# EAGLE design luftdaten_v1r1 (EAGLE 9.3.0)
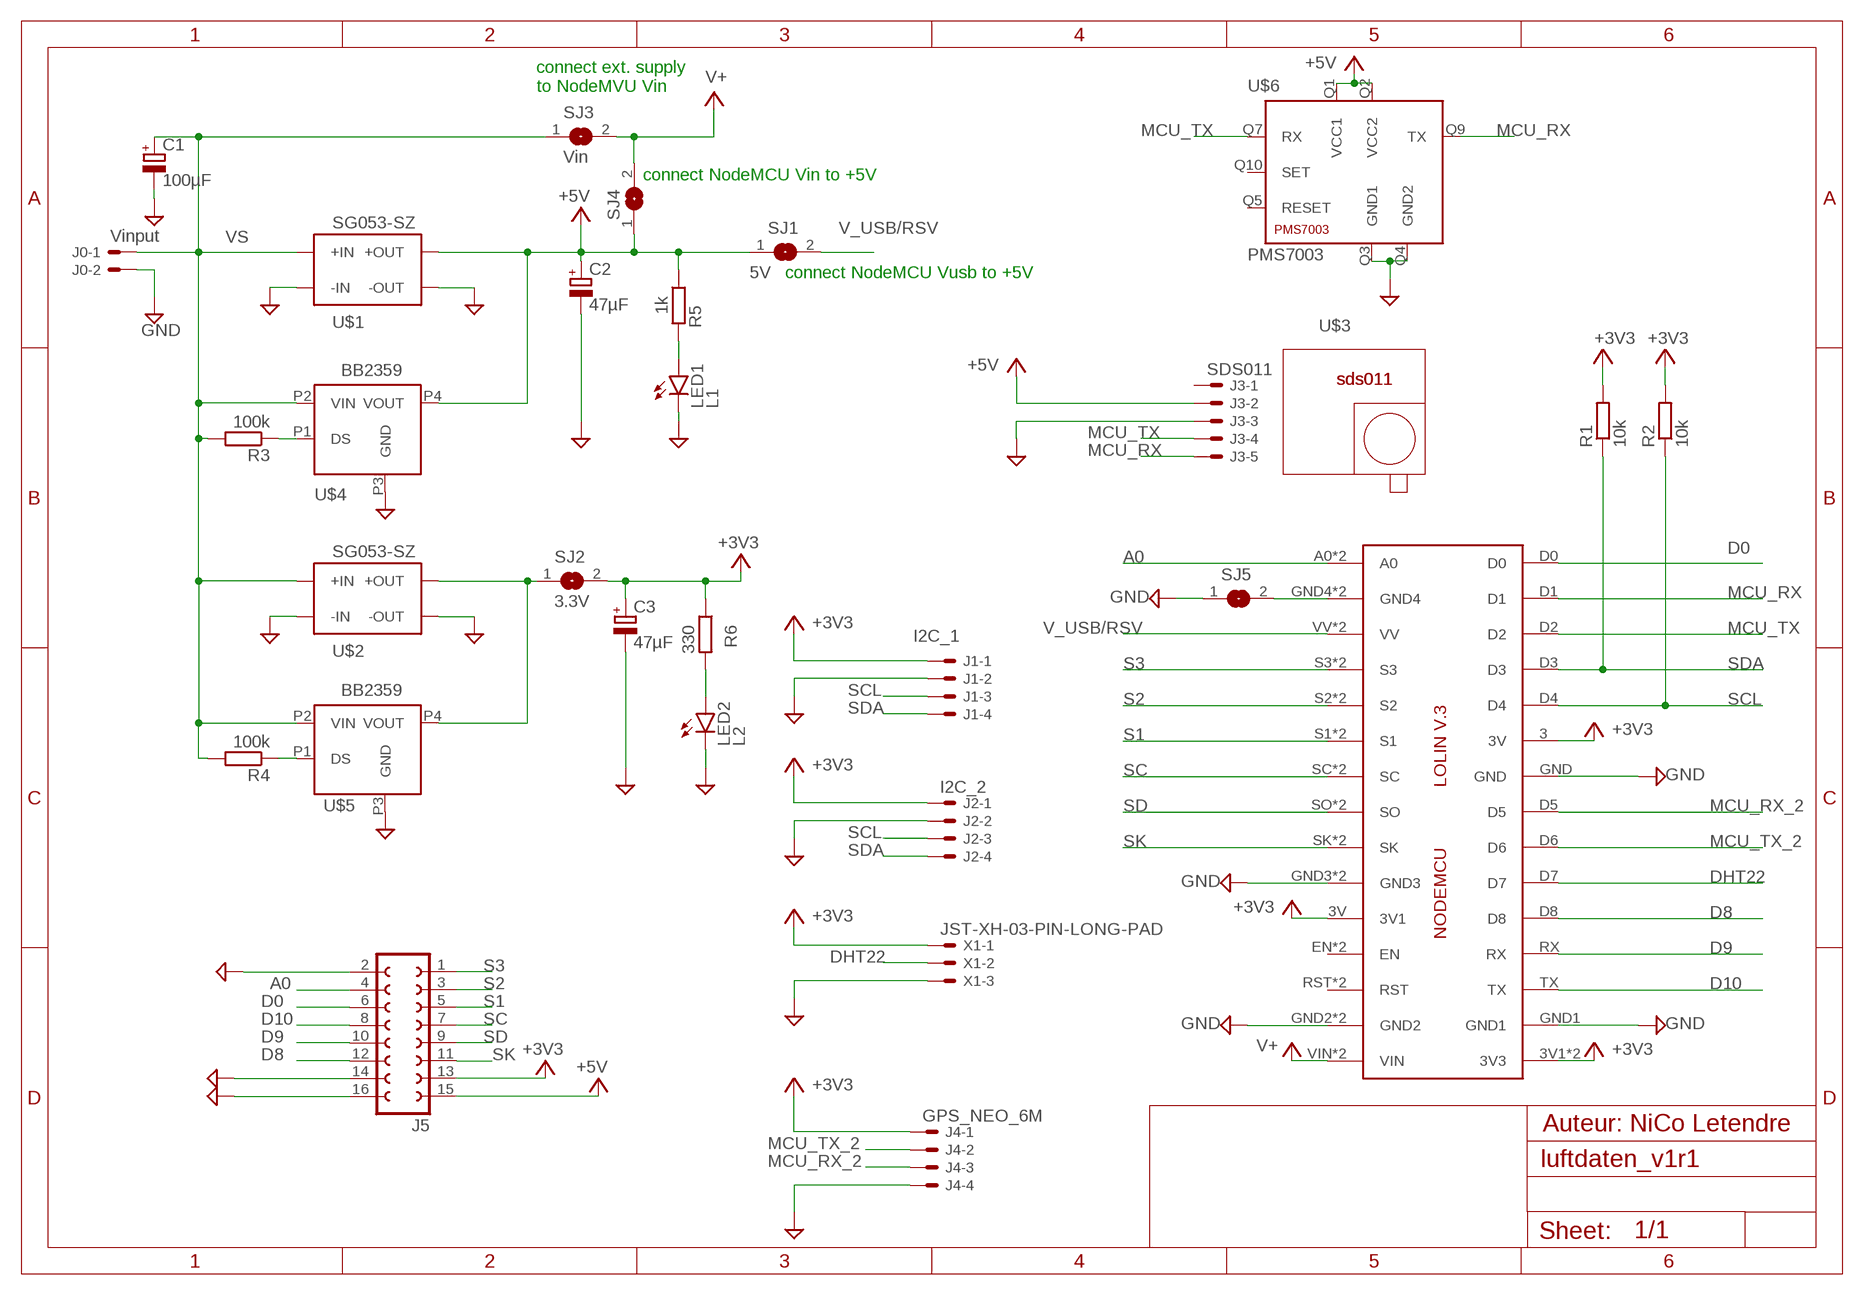
[diagram p0: schematic, sheet 1]

## Parts
C1  100µF  CPOL-EUE3.5-8  [E3,5-8]
C2  47µF  CPOL-EUE2.5-5  [E2,5-5]
C3  47µF  CPOL-EUE2.5-5  [E2,5-5]
IC2  NodeMCU  LOLINV3  [LOLINV3]
J0  Vinput  JST-XH-02-PIN-LONG-PAD  [JST-XH-02-PACKAGE-LONG-PAD]
J1  I2C_1  JST-XH-04-PIN-LONG-PAD  [JST-XH-04-PACKAGE-LONG-PAD]
J2  I2C_2  JST-XH-04-PIN-LONG-PAD  [JST-XH-04-PACKAGE-LONG-PAD]
J3  SDS011  JST-XH-05-PIN-LONG-PAD  [JST-XH-05-PACKAGE-LONG-PAD]
J4  GPS_NEO_6M  JST-XH-04-PIN-LONG-PAD  [JST-XH-04-PACKAGE-LONG-PAD]
J5  FE08-2  [FE08-2]
LED1  L1  LEDCHIPLED_0805  [CHIPLED_0805]
LED2  L2  LEDCHIPLED_0805  [CHIPLED_0805]
R1  10k  R-EU_R0805  [R0805]
R2  10k  R-EU_R0805  [R0805]
R3  100k  R-EU_R0805  [R0805]
R4  100k  R-EU_R0805  [R0805]
R5  1k  R-EU_R0805  [R0805]
R6  330  R-EU_R0805  [R0805]
SJ1  5V  SJ  [SJ]
SJ2  3.3V  SJ  [SJ]
SJ3  Vin  SJ  [SJ]
SJ4  SJ  [SJ]
SJ5  SJ  [SJ]
U$1  SG053-SZ  [SG053-SZ]
U$2  SG053-SZ  [SG053-SZ]
U$3  SDSO11  [SDS011]
U$4  BB2359  [BB2359]
U$5  BB2359  [BB2359]
U$6  PMS7003  [PMS7003]
X1  JST-XH-03-PIN-LONG-PAD  [JST-XH-03-PACKAGE-LONG-PAD]

## Nets
+3V3: C3.+ IC2.3(3V) IC2.3V1(3V3) IC2.3V3 IC2.3V(3V1) J1.1 J2.1 J4.1 J5.13 R1.2 R2.2 R6.1 SJ2.2 X1.1
+5V: C2.+ J3.2 J5.15 R5.1 SJ1.1 SJ4.1 U$1.P$5(+OUT) U$1.P$6(+OUT) U$4.P4(VOUT) U$6.Q1(VCC1) U$6.Q2(VCC2)
A0: IC2.A0 IC2.A1(A0) J5.4
D0: IC2.D0 J5.6
D8: IC2.D8 J5.12
D9: IC2.RX J5.10
D10: IC2.TX J5.8
DHT22: IC2.D7 X1.2
GND: C1.- C2.- C3.- IC2.GND IC2.GND1 IC2.GND2 IC2.GND3 IC2.GND5(GND2) IC2.GND6(GND3) J0.2 J1.2 J2.2 J3.3 J4.4 J5.2 J5.14 J5.16 LED1.C LED2.C SJ5.1 U$1.P$1(-IN) U$1.P$2(-IN) U$1.P$7(-OUT) U$1.P$8(-OUT) U$2.P$1(-IN) U$2.P$2(-IN) U$2.P$7(-OUT) U$2.P$8(-OUT) U$4.P3(GND) U$5.P3(GND) U$6.Q3(GND1) U$6.Q4(GND2) X1.3
MCU_RX: IC2.D1 J3.5 U$6.Q9(TX)
MCU_RX_2: IC2.D5 J4.3
MCU_TX: IC2.D2 J3.4 U$6.Q7(RX)
MCU_TX_2: IC2.D6 J4.2
N$1: IC2.GND4 IC2.GND7(GND4) SJ5.2
N$2: SJ2.1 U$2.P$5(+OUT) U$2.P$6(+OUT) U$5.P4(VOUT)
N$3: R3.1 U$4.P1(DS)
N$4: R4.1 U$5.P1(DS)
N$7: LED1.A R5.2
N$8: LED2.A R6.2
S1: IC2.S1 IC2.S4(S1) J5.5
S2: IC2.S2 IC2.S5(S2) J5.3
S3: IC2.S3 IC2.S6(S3) J5.1
SC: IC2.SC IC2.SC1(SC) J5.7
SCL: IC2.D4 J1.3 J2.3 R2.1
SD: IC2.SO IC2.SO1(SO) J5.9
SDA: IC2.D3 J1.4 J2.4 R1.1
SK: IC2.SK IC2.SK1(SK) J5.11
V+: IC2.VIN IC2.VIN1(VIN) SJ3.2 SJ4.2
V_USB/RSV: IC2.VV IC2.VV1(VV) SJ1.2
VS: C1.+ J0.1 R3.2 R4.2 SJ3.1 U$1.P$3(+IN) U$1.P$4(+IN) U$2.P$3(+IN) U$2.P$4(+IN) U$4.P2(VIN) U$5.P2(VIN)
Unconnected: IC2.EN IC2.EN1(EN) IC2.RST IC2.RST1(RST) J3.1 U$6.Q5(RESET) U$6.Q10(SET)

## Notes on the sheet
- connect ext. supply
  to NodeMVU Vin
- connect NodeMCU Vin to +5V
- connect NodeMCU Vusb to +5V
- Auteur: NiCo Letendre

## Library data of the parts
C1-C3 = rcl-perso:CPOL-EU: POLARIZED CAPACITOR, European symbol; SPICEPREFIX: C
IC2 = Lolin:LOLINV3
J0 = Rembrandt Electronics - JST XH Connectors v1-0:JST-XH-02-PIN: JST XH Connector 2 Pin Wire to board connector. Pitch: 2,54 mm, (0.100") Number of pins: 2 Created by Rembrandt Electronics www.rembrandtelectronics.com
J1 J2 J4 = Rembrandt Electronics - JST XH Connectors v1-0:JST-XH-04-PIN: JST XH Connector 2 Pin Wire to board connector. Pitch: 2,54 mm, (0.100") Number of pins: 4 Created by Rembrandt Electronics www.rembrandtelectronics.com
J3 = Rembrandt Electronics - JST XH Connectors v1-0:JST-XH-05-PIN: JST XH Connector 2 Pin Wire to board connector. Pitch: 2,54 mm, (0.100") Number of pins: 5 Created by Rembrandt Electronics www.rembrandtelectronics.com
J5 = header-1p27-perso:FE08-2: FEMALE HEADER; OC_FARNELL: unknown; OC_NEWARK: unknown
LED1 LED2 = led:LED: LED OSRAM: - CHIPLED LG R971, LG N971, LY N971, LG Q971, LY Q971, LO R971, LY R971 LH N974, LH R974 LS Q976, LO Q976, LY Q976 LO Q996 - Hyper CHIPLED LW Q18S LB Q993, LB Q99A, LB R99A - SideLED LS A670, LO A670, LY A670, LG A670, LP A670 LB A673, LV A673, LT A673, LW A673 LH A674 LY A675 LS A676, LA A676, LO A676, LY A676, LW A676 LS A679, LY A679, LG A679 - Hyper Micro SIDELED® LS Y876, LA Y876, LO Y876, LY Y876 LT Y87S - SmartLED LW L88C, LW L88S LB L89C, LB L89S, LG L890 LS L89K, LO L89K, LY L89K LS L896, LA L896, LO L896, LY L896 - TOPLED LS T670, LO T670, LY T670, LG T670, LP T670 LSG T670, LSP T670, LSY T670, LOP T670, LYG T670 LG T671, LOG T671, LSG T671 LB T673, LV T673, LT T673, LW T673 LH T674 LS T676, LA T676, LO T676, LY T676, LB T676, LH T676, LSB T676, LW T676 LB T67C, LV T67C, LT T67C, LS T67K, LO T67K, LY T67K, LW E67C LS E67B, LA E67B, LO E67B, LY E67B, LB E67C, LV E67C, LT E67C LW T67C LS T679, LY T679, LG T679 LS T770, LO T770, LY T770, LG T770, LP T770 LB T773, LV T773, LT T773, LW T773 LH T774 LS E675, LA E675, LY E675, LS T675 LS T776, LA T776, LO T776, LY T776, LB T776 LHGB T686 LT T68C, LB T68C - Hyper Mini TOPLED® LB M676 - Mini TOPLED Santana® LG M470 LS M47K, LO M47K, LY M47K Source: http://www.osram.convergy.de LUXEON: - LUMILED® LXK2-PW12-R00, LXK2-PW12-S00, LXK2-PW14-U00, LXK2-PW14-V00 LXK2-PM12-R00, LXK2-PM12-S00, LXK2-PM14-U00 LXK2-PE12-Q00, LXK2-PE12-R00, LXK2-PE12-S00, LXK2-PE14-T00, LXK2-PE14-U00 LXK2-PB12-K00, LXK2-PB12-L00, LXK2-PB12-M00, LXK2-PB14-N00, LXK2-PB14-P00, LXK2-PB14-Q00 LXK2-PR12-L00, LXK2-PR12-M00, LXK2-PR14-Q00, LXK2-PR14-R00 LXK2-PD12-Q00, LXK2-PD12-R00, LXK2-PD12-S00 LXK2-PH12-R00, LXK2-PH12-S00 LXK2-PL12-P00, LXK2-PL12-Q00, LXK2-PL12-R00 Source: www.luxeon.com KINGBRIGHT: KA-3528ASYC Source: www.kingbright.com
R1-R6 = rcl:R-EU_: RESISTOR, European symbol; SPICEPREFIX: R
SJ1-SJ5 = jumper:SJ: SMD solder JUMPER
U$1 U$2 = dcdc-powermodules:SG053-SZ
U$3 = sds011:SDSO11
U$4 U$5 = bb2359:BB2359
U$6 = pms7003:PMS7003
X1 = Rembrandt Electronics - JST XH Connectors v1-0:JST-XH-03-PIN: JST XH Connector 2 Pin Wire to board connector. Pitch: 2,54 mm, (0.100") Number of pins: 3 Created by Rembrandt Electronics www.rembrandtelectronics.com

## Board
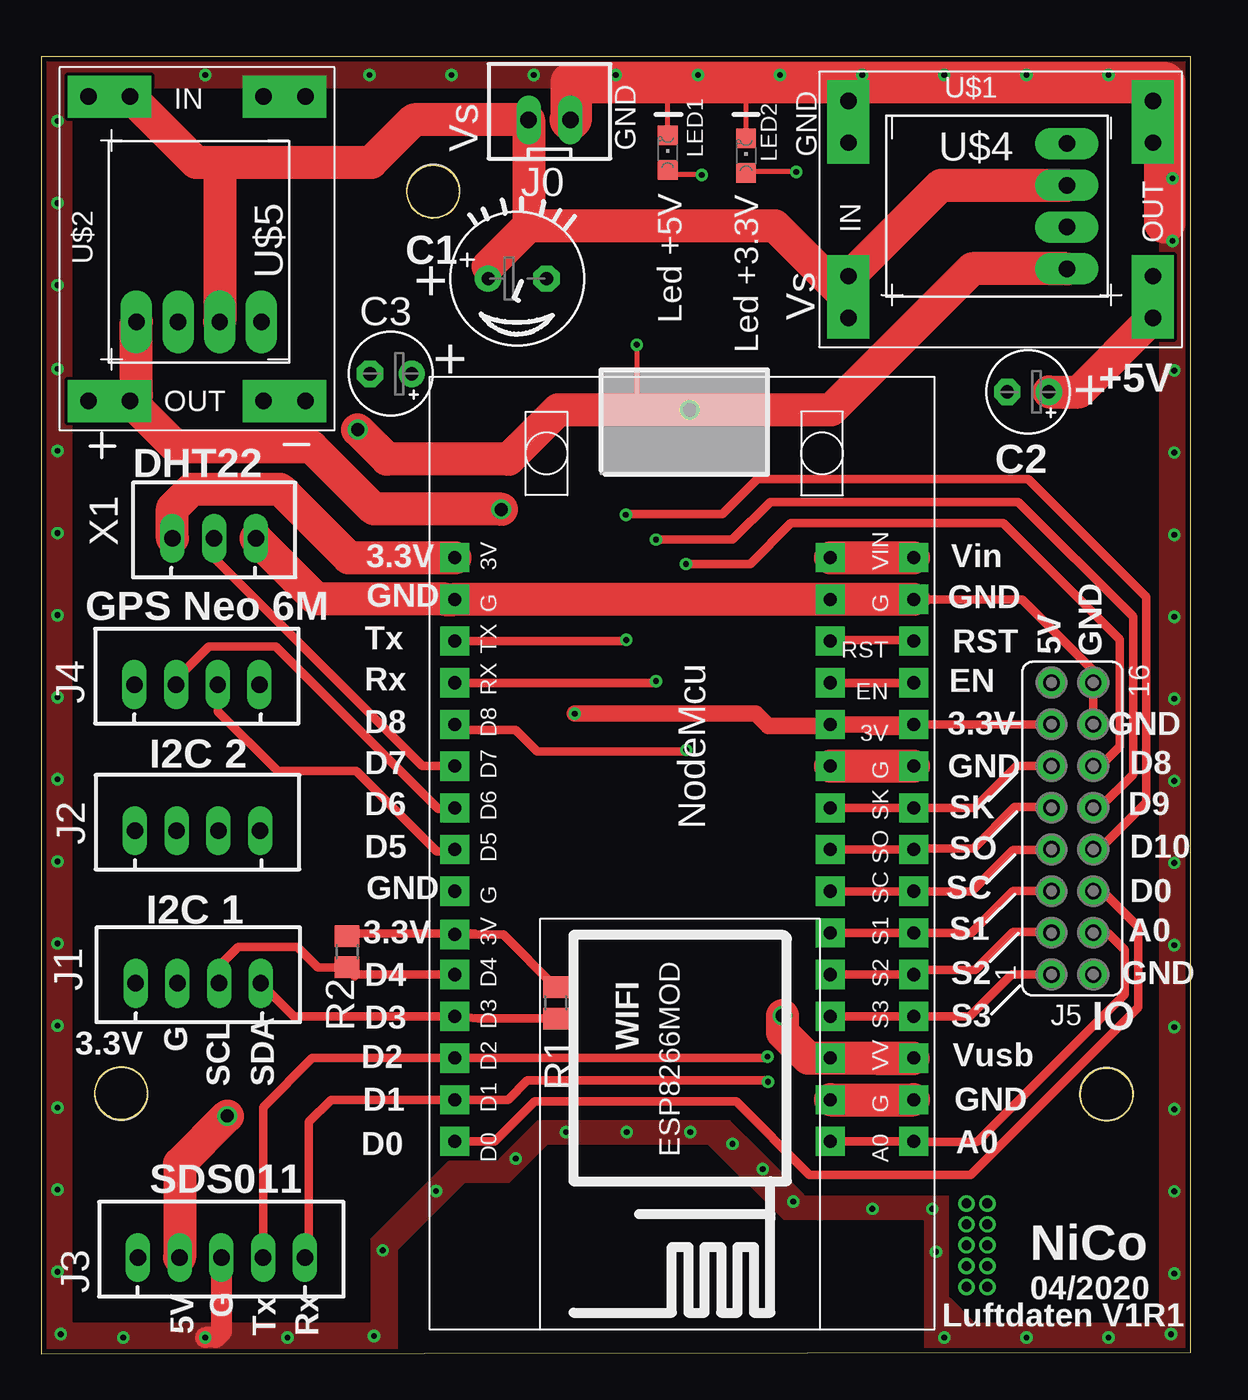
[diagram p1: board, top side]
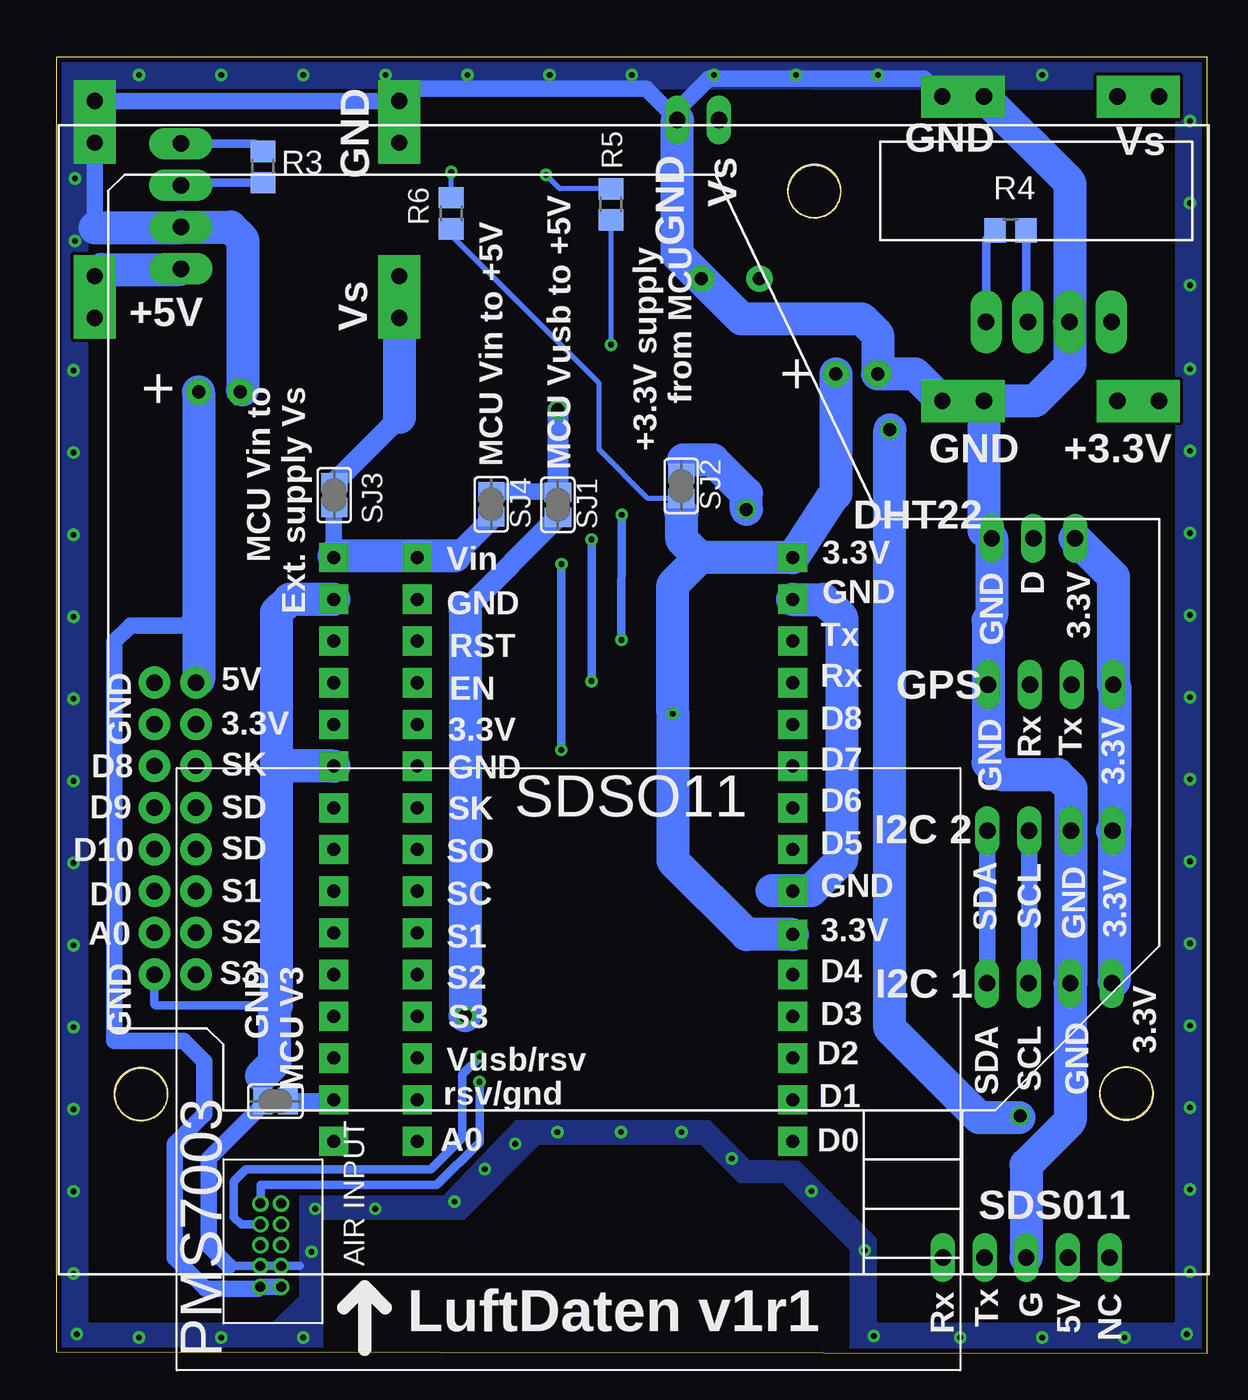
[diagram p2: board, bottom side, seen from below]

Size 70 x 79 mm. Coordinates in mm from the lower left corner, seen from the top.
Outline: 0,0 70,0.1 70,79 0,79 0,0
Copper layers (1*16): Top 0.035mm / dielectric 1.5mm / Bottom 0.035mm
Design rules "jlcpcb_rules *": minimum track width 6mil, minimum drill 0.35mm, track to track 0.2mm, track to pad 0.2mm, pad to pad 0.2mm, via to via 0.2mm, smd to smd 0.2mm, copper to edge 0.3mm, drill to drill 0.2mm, minimum pad ring 0.2mm, minimum via ring 0.2mm, stop-mask expansion 4mil, vias tented up to drill 0mil, thermal gap 10mil

### Footprints (pad centres in the part's own frame; a part is rotated, then mirrored left to right if it is on the bottom)
E3,5-8 = drill 0.8 pad 1.6: + -1.778,0 | drill 0.8 pad 1.6 octagon: - 1.778,0
E2,5-5 = drill 0.8 pad 1.6: + -1.27,0 | drill 0.8 pad 1.6 octagon: - 1.27,0
LOLINV3 = drill 0.8 pad 1.778 square: 3 24.03,29.21; 3V 46.99,29.21; 3V1 36.83,6.35; 3V3 36.83,1.27; A0 11.43,1.27; A1 11.43,6.35; D0 11.43,29.21; D1 13.97,29.21; D2 16.51,29.21; D3 19.05,29.21; D4 21.59,29.21; D5 29.21,29.21; D6 31.75,29.21; D7 34.29,29.21; D8 36.83,29.21; EN 39.37,1.27; EN1 39.37,6.35; GND 26.67,29.21; GND1 44.45,29.21; GND2 44.45,1.27; GND3 34.29,1.27; GND4 13.97,1.27; GND5 44.45,6.35; GND6 34.29,6.35; GND7 13.97,6.35; RST 41.91,1.27; RST1 41.91,6.35; RX 39.37,29.21; S1 24.13,1.27; S2 21.59,1.27; S3 19.05,1.27; S4 24.13,6.35; S5 21.59,6.35; S6 19.05,6.35; SC 26.67,1.27; SC1 26.67,6.35; SK 31.75,1.27; SK1 31.75,6.35; SO 29.21,1.27; SO1 29.21,6.35; TX 41.91,29.21; VIN 46.99,1.27; VIN1 46.99,6.35; VV 16.51,1.27; VV1 16.51,6.35
JST-XH-02-PACKAGE-LONG-PAD = drill 1 long: 1 -1.27,0; 2 1.27,0
JST-XH-04-PACKAGE-LONG-PAD = drill 1 long: 1 -3.81,0; 2 -1.27,0; 3 1.27,0; 4 3.81,0
JST-XH-05-PACKAGE-LONG-PAD = drill 1 long: 1 -5.08,0; 2 -2.54,0; 3 0,0; 4 2.54,0; 5 5.08,0
FE08-2 = drill 1 pad 1.93: 1 -8.89,1.27; 2 -8.89,-1.27; 3 -6.35,1.27; 4 -6.35,-1.27; 5 -3.81,1.27; 6 -3.81,-1.27; 7 -1.27,1.27; 8 -1.27,-1.27; 9 1.27,1.27; 10 1.27,-1.27; 11 3.81,1.27; 12 3.81,-1.27; 13 6.35,1.27; 14 6.35,-1.27; 15 8.89,1.27; 16 8.89,-1.27
CHIPLED_0805 = smd 1.2 x 1.2: A 0,-1.05; C 0,1.05
R0805 = smd 1.3 x 1.5: 1 -0.95,0; 2 0.95,0
SJ = smd 1.168 x 1.6: 1 -0.762,0; 2 0.762,0
SG053-SZ = drill 1 pad 2.54 square: P$1 -8.382,6.096; P$2 -8.382,3.556; P$3 -8.382,-4.572; P$4 -8.382,-7.112; P$5 10.16,-7.112; P$6 10.16,-4.572; P$7 10.16,3.556; P$8 10.16,6.096
SDS011 = hole 3.2: -30,-24; 30,-24; 11,31
BB2359 = drill 1 pad 1.93 long: P1 0,-3.81; P2 0,-1.27; P3 0,1.27; P4 0,3.81
PMS7003 = drill 0.6 pad 0.9: Q1 5.08,-5.08; Q2 5.08,-6.35; Q3 6.35,-5.08; Q4 6.35,-6.35; Q5 7.62,-5.08; Q6 7.62,-6.35; Q7 8.89,-5.08; Q8 8.89,-6.35; Q9 10.16,-5.08; Q10 10.16,-6.35
JST-XH-03-PACKAGE-LONG-PAD = drill 1 long: 1 -2.54,0; 2 0,0; 3 2.54,0

### Placement (x,y rotation side)
C1  29,65.5 0 top
C2  60.1,58.6 180 top
C3  21.3,59.7 180 top
IC2  54.41,1.51 90 top
J0  30.96,75.17 0 top
J1  9.57,22.57 0 top
J2  9.53,31.87 0 top
J3  10.98,5.86 0 top
J4  9.49,40.77 0 top
J5  62.8,32 90 top
LED1  38.16,73.17 0 top
LED2  42.93,72.99 0 top
R1  31.34,21.38 90 top
R2  18.64,24.5 90 top
R3  57.46,72.29 270 bottom
R4  11.94,68.44 0 bottom
R5  36.27,70.02 90 bottom
R6  45.99,69.48 90 bottom
SJ1  39.5,51.72 270 bottom
SJ2  31.99,52.87 270 bottom
SJ3  53.12,52.31 270 bottom
SJ4  43.56,51.75 270 bottom
SJ5  56.7,15.39 0 bottom
U$1  57.54,70.22 0 top
U$2  10,68.2 270 top
U$3  34.88,39.84 0 bottom
U$4  62.46,69.91 180 top
U$5  9.61,62.87 90 top
U$6  62.7,-1 90 bottom
X1  10.54,49.67 0 top

### Tracks (layer width: path | path; a pad name or v marks a point on that pad's centre or on a via)
+3V3  (via drill 0.35)
  Top 0.508: R2.2 18.79,25.6 26.41,25.6 IC2.3 28.13,25.54 R1.2 | IC2.3V3 J5.13
  Top 1.016: 50.5,38.2 53,38.2 | 53,38.2 IC2.3V3 | v32.5,39 43.53,39 44.28,38.25 47.97,38.25 IC2.3V1 52.86,38.34 53,38.2
  Top 2: X1.1 8,51.5 9.17,52.67 14.56,52.67 18.73,48.5 IC2.3V
  Bottom 0.305: SJ2.2 34.02,52.11 36.99,55.08 36.99,59.13 45.99,68.13 R6.1
  Bottom 0.61: 32.04,51.3 31.99,51.35 SJ2.2
  Bottom 1.016: 5.59,32 J2.1 | J1.1 5.63,22.7 | 22.57,52.4 22.78,52.19
  Bottom 2: IC2.3 28,25.54 32.5,30.04 v32.5,39 32.5,46.86 30.86,48.5 | X1.1 5.68,47.35 J4.1 5.59,40.68 5.59,32 | J2.1 5.63,31.78 5.63,22.7 | 22.78,52.19 IC2.3V 30.86,48.5 | C3.+ 22.57,52.4 | 30.86,48.5 31.95,49.59 31.95,51.21 32.04,51.3
+5V  (via drill 0.35, 0.8)
  Top 0.305: 37.62,57.77 37.89,57.5 | v36.27,61.47 36.27,57.59 36.18,57.5
  Top 2: U$4.P4 56.7,66.1 48.1,57.5 v39.5,57.5 37.89,57.5 36.18,57.5 31.47,57.5 28.47,54.5 21.08,54.5 v19.28,56.3 | C2.+ 63.19,58.6 U$1.P$5 | v11.34,14.49 8.44,11.59 J3.2
  Bottom 0.305: R5.1 v36.27,61.47
  Bottom 1.016: U$4.P4 62.51,66.05 | 67.3,66.05 U$1.P$6 U$1.P$5 | SJ4.1 39.53,52.51 SJ1.1 | 11.43,14.4 v11.34,14.49 | 61.37,41.05 J5.15 | 61.37,44.82 61.82,44.37 65.52,44.37 66.51,43.38 66.51,19.08 62.28,19.08 61.02,17.82 61.02,14.58 62.82,12.78 62.82,5.85 60.93,3.96 57.74,3.96 U$6.Q1 U$6.Q2
  Bottom 1.27: v39.5,57.5 SJ1.1
  Bottom 2: 67.3,66.05 62.51,66.05 | v19.28,56.3 19.29,19.83 13.86,14.4 11.43,14.4 | C2.+ 61.37,44.82 61.37,41.05
A0
  Top 0.508: IC2.A0 53.18,12.9 53.46,12.9 | 53.46,12.9 57,12.9 66,21.9 66,24.6 64.95,25.65 J5.4 | IC2.A1 53.42,12.94 53.46,12.9
D0
  Top 0.508: IC2.D0 27.64,12.94 30.07,15.37 42.32,15.37 46.79,10.9 56.6,10.9 66.8,21.1 66.8,26 64.61,28.19 J5.6
D8  (via drill 0.35)
  Top 0.508: v39.29,36.78 39.29,36.7 30.2,36.7 28.9,38 25.54,38 IC2.D8 | v39.28,48.11 43.17,48.11 45.66,50.6 58.6,50.6 65.7,43.5 65.7,37 64.71,36.01 64.27,36.01 J5.12
  Bottom 0.508: v39.29,36.78 39.28,36.85 v39.28,48.11
D9  (via drill 0.35)
  Top 0.508: v37.45,49.6 42.1,49.6 44.4,51.9 59.5,51.9 66.5,44.9 66.5,35.3 64.45,33.25 64.09,33.25 J5.10 | IC2.RX 37.35,40.88 v37.45,40.98
  Bottom 0.508: v37.45,49.6 v37.45,40.98
D10  (via drill 0.35)
  Top 0.508: v35.61,51.11 35.67,51.17 41.47,51.17 43.6,53.3 60.1,53.3 67.3,46.1 67.3,33.6 64.43,30.73 J5.8 | IC2.TX 35.56,43.42 v35.63,43.49
  Bottom 0.508: v35.63,43.49 v35.61,51.11
DHT22
  Top 0.508: X1.2 10.54,48.47 23.21,35.8 IC2.D7
GND  (via drill 0.35)
  Top 0.305: LED1.C 38.16,77.25 37.98,77.43 | LED2.C 42.93,76.59 43.11,76.77 42.66,77.22 42.66,77.43
  Top 0.508: IC2.GND2 59.74,45.96 64.02,41.68 64.02,40.94 J5.16 J5.14
  Top 1.016: 24.52,45.98 24.54,45.96
  Top 1.27: J3.3 10.98,1.35 10.62,0.99 10.61,1 v10,1
  Top 2: 24.52,45.98 16.77,45.98 X1.3 | 24.54,45.96 IC2.GND1 IC2.GND5 IC2.GND2 | IC2.GND6 IC2.GND3
  Top 2.54: J0.2 32.3,75.24 32.3,77.43 37.98,77.43 42.66,77.43 68.4,77.43 68.43,77.4 68.43,68.9
  Bottom 0.508: J5.2 64.07,21.32 63.99,21.24 56.64,21.24 | 59.54,5.36 59.53,5.35 U$6.Q3 U$6.Q4 55.21,5.35
  Bottom 1.016: 67.7,68.6 U$1.P$7 U$1.P$8 U$1.P$1 U$1.P$2 49.16,77.07 34.13,77.07 J0.2 32.23,75.77 30.32,77.68 17.2,77.68 U$2.P$1 U$2.P$2 | 62.5,68.6 U$4.P3 | 26.45,28.2 IC2.GND | 56.64,35.98 53.32,35.98 IC2.GND3 | J1.2 8.26,22.61 | 13.56,50.15 X1.3 | 13.08,44.92 13.3,44.7 | 57.55,16.94 57.55,15.48 SJ5.1 57.46,15.17 60.75,11.88 60.75,6.57 59.54,5.36
  Bottom 1.27: 58.7,58.73 C2.-
  Bottom 2: 67.7,68.6 62.5,68.6 | U$2.P$2 8.34,71.37 U$5.P3 8.34,60.16 10.46,58.04 U$2.P$7 | U$2.P$7 U$2.P$8 17.76,59.7 C3.- 20.03,62.08 21,63.05 28.33,63.05 C1.- 32.23,66.95 J0.2 | IC2.GND1 23.31,45.96 22.22,44.87 22.22,30.08 24.1,28.2 26.45,28.2 | 56.64,35.98 56.64,21.24 56.73,21.15 56.73,17.76 57.55,16.94 | IC2.GND3 56.64,35.8 56.64,45.16 55.84,45.96 IC2.GND2 | 8.26,22.61 J2.2 8.26,34.47 9.09,35.3 12.6,35.3 13.3,36 J4.4 13.3,44.7 | J1.2 8.3,14.2 10.98,11.52 J3.3 | U$2.P$7 13.56,50.15 | X1.3 13.08,44.92 | U$4.P3 59.44,68.64 58.7,67.9 58.7,58.73
  other vias: 1,70.1 1,65.1 1,60 1,55 1,50 1,45 1,40 1,35 1,30 1,25 1,20 1,15 1,10 1,5 1.2,1.2 1,75.1 5,1 15,1 20.27,1.09 42.1,12.79 43.95,11.26 45.8,9.28 50.62,8.83 54.27,8.83 54.5,6.22 55,1 60,1 65,1 10,77.9 20,77.9 25,77.9 30,77.9 35,77.9 40,77.9 45,77.9 50,77.9 55,77.9 60,77.9 65,77.9 68.9,71.6 68.9,67.8 69,59.9 69,54.9 69,49.9 69,44.9 69,39.9 69,34.9 69,29.9 69,24.9 69,19.9 69,14.9 69,9.9 69,4.9 68.8,1.2 20.81,6.31 24.05,9.91 28.91,11.89 31.97,13.51 35.66,13.51 39.53,13.51
  cutout Bottom (no thermals): 68,2 58.32,1.98 56.88,1.98 55.35,3.51 55.35,9.63 55.26,9.72 46.49,9.72 42.08,14.31 30.24,14.31 27.81,11.88 24.79,11.82 19.98,7.01 19.98,2 2,2 2,76.9 68,77
  pour Bottom (no thermals): -1.6,80.3 72.4,80.3 74.6,78.1 74.6,0.3 72.8,-1.5 -2.6,-1.5 -2.9,-1.2
  cutout Top (no thermals): 68,2 56.86,2 55.35,3.51 55.35,9.72 46.53,9.72 41.94,14.31 30.24,14.31 27.78,11.85 24.81,11.85 19.98,7.02 19.98,2 2,2 2,77 68,77
  pour Top (no thermals): -0.7,79.9 70.8,79.9 70.9,80 70.9,-0.6 70.7,-0.8 -1,-0.5
  cutout Top: 53.73,-0.36 21.78,-0.36 21.78,6.3 25.83,10.35 28.53,10.35 30.88,12.7 40.58,12.7 45.18,8.1 53.73,8.1
  cutout Bottom: 21.87,-0.46 21.78,-0.46 21.78,6.3 25.83,10.35 28.53,10.35 30.87,12.69 40.59,12.69 45.18,8.1 53.73,8.1 53.73,-0.54
MCU_RX  (via drill 0.35)
  Top 0.508: J3.5 16.3,6.1 16.3,14.12 17.66,15.48 IC2.D1 28.45,15.48 29.62,16.65 44.19,16.65 v44.27,16.57
  Bottom 0.508: v44.27,16.57 44.27,12.89 46.86,10.3 57.6,10.3 57.6,9.18 U$6.Q9
MCU_RX_2
  Top 0.508: J4.3 10.76,39.14 14.4,35.5 19.2,35.5 24.1,30.6 25.08,30.6 IC2.D5
MCU_TX  (via drill 0.35)
  Top 0.508: J3.4 13.52,15.02 16.52,18.02 IC2.D2 44.16,18.02 v44.24,18.1
  Bottom 0.508: v44.24,18.1 45.32,17.02 45.32,13.15 47.24,11.23 58.52,11.23 59.23,10.52 59.23,8.33 58.79,7.89 U$6.Q7
MCU_TX_2
  Top 0.508: J4.2 8.22,41.12 10.2,43.1 14.3,43.1 24.2,33.2 25.14,33.2 IC2.D6
N$1
  Top 2: IC2.GND7 IC2.GND4
  Bottom 0.508: 53.05,15.39 IC2.GND4
  Bottom 1.016: SJ5.2 53.05,15.39
N$2  (via drill 0.8)
  Top 1.016: 5.8,58.41 U$2.P$6 U$2.P$5 | v28.02,51.44 28.04,51.45
  Top 2: 5.8,58.41 U$5.P4 | U$2.P$6 8.23,55.24 16.49,55.24 20.26,51.47 28.04,51.45
  Bottom 0.61: 31.86,54.45 31.86,53.76 SJ2.1
  Bottom 2: v28.02,51.44 28.02,52.41 30.06,54.45 31.86,54.45
N$3
  Bottom 0.508: R3.1 57.94,73.72 U$4.P1
N$4
  Bottom 0.508: R4.1 13.42,67.91 U$5.P1
N$5
  Top 0.508: 53.19,43.47 48.51,43.47
N$6
  Top 0.508: 48.51,40.86 52.83,40.86
N$7  (via drill 0.35)
  Top 0.305: v40.23,71.82 38.46,71.82 LED1.A
  Bottom 0.305: R5.2 39.38,70.97 v40.23,71.82
N$8  (via drill 0.35)
  Top 0.305: v45.99,72 42.99,72 LED2.A
  Bottom 0.305: R6.2 45.99,71.82 46.08,71.91 v45.99,72
S1
  Top 0.508: J5.5 61.45,28.19 61.44,28.2 59.2,28.2 56.64,25.64 53.55,25.64 IC2.S1 IC2.S4
S2
  Top 0.508: J5.3 61.48,25.7 59.2,25.7 56.9,23.4 53.44,23.4 IC2.S2 IC2.S5
S3
  Top 0.508: J5.1 59.11,23.11 56.56,20.56 IC2.S3 IC2.S6
SC
  Top 0.508: J5.7 61.5,30.7 59.2,30.7 56.68,28.18 IC2.SC IC2.SC1
SCL
  Top 0.508: J1.3 10.84,23.64 12,24.8 15.59,24.8 16.84,23.55 R2.1 18.64,23.45 19.09,23 19.19,23.1 IC2.D4
  Bottom 1.016: J2.3 10.8,22.61 J1.3
SD
  Top 0.508: J5.9 61.5,33.3 59.3,33.3 56.8,30.8 53.22,30.8 IC2.SO IC2.SO1
SDA
  Top 0.508: J1.4 15.39,20.56 IC2.D3 26.6,20.43 R1.1
  Bottom 1.016: J2.4 13.34,22.61 J1.4
SK
  Top 0.508: J5.11 59.41,35.81 56.86,33.26 IC2.SK IC2.SK1
V+
  Top 2: IC2.VIN1 IC2.VIN
  Bottom 1.016: IC2.VIN 53.14,48.6 53.14,51.53 SJ3.2
  Bottom 1.27: 45.77,48.6 43.56,50.81 SJ4.2
  Bottom 2: 45.77,48.6 53.14,48.6
V_USB/RSV  (via drill 0.8)
  Top 1.016: 53.11,17.99 IC2.VV
  Top 2: 50.99,17.99 53.11,17.99 53.08,18.02 IC2.VV1 46.69,18.02 45.14,19.57 v45.14,20.6
  Bottom 1.27: SJ1.2 45.14,45.32
  Bottom 2: 45.14,45.32 v45.14,20.6
VS
  Top 1.016: U$2.P$3 U$2.P$4 | 49.16,64.24 U$1.P$4 | U$1.P$3 49.26,65.65 | 27.22,66.25 C1.+
  Top 1.27: U$1.P$3 U$1.P$4
  Top 2: U$2.P$3 9.43,72.58 10.88,72.58 | 49.26,65.65 54.79,71.18 U$4.P2 | 10.88,72.58 20.11,72.58 22.7,75.17 J0.1 29.69,68.72 | 10.88,72.58 U$5.P2 | 29.69,68.72 27.22,66.25 | 29.69,68.72 44.68,68.72 49.16,64.24
  Bottom 0.508: R4.2 10.99,62.98 U$5.P2 | R3.2 62.3,71.34 U$4.P2
  Bottom 1.27: 49.16,57.03 SJ3.1
  Bottom 2: U$1.P$4 49.16,57.03

### Text on the board
tPlace: + | + | + | 3.3V | Vin | GND | GND | Tx | RST | 5V | GND | Rx | EN | GND | D8 | 3.3V | D7 | GND | D8 | D6 | SK | D9 | D5 | SO | D10 | GND | SC | D0 | 3.3V | S1 | A0 | D4 | S2 | GND | 3.3V | D3 | S3 | G | Vusb | D2 | SCL | SDA | D1 | GND | D0 | A0 | NiCo | 04/2020 | G | Luftdaten V1R1 | 5V | Tx | Rx
bPlace: GND | Vs | GND | Vs | GND | MCU Vusb to +5V | MCU Vin to +5V | +3.3V supply / from MCU | Vs | +5V | MCU Vin to / Ext. supply Vs | + | + | +3.3V | GND | DHT22 | 3.3V | D | GND | 3.3V | Vin | GND | GND | Tx | RST | GND | Rx | GPS | EN | 5V | 3.3V | Tx | Rx | GND | D8 | 3.3V | 3.3V | D7 | GND | SK | D8 | D6 | SK | SD | D9 | I2C 2 | 3.3V | GND | SCL | SDA | D5 | SO | SD | D10 | GND | S1 | SC | D0 | 3.3V | S1 | S2 | A0 | GND / MCU V3 | GND | D4 | 3.3V | I2C 1 | S2 | S3 | GND | SCL | SDA | D3 | S3 | D2 | Vusb/rsv | PMS7003 | D1 | rsv/gnd | D0 | A0 | SDS011 | NC | 5V | G | Tx | Rx | LuftDaten v1r1
tNames: Vs | GND | GND | Led +5V | Vs | Led +3.3V | +5V | - | DHT22 | GPS Neo 6M | I2C 2 | I2C 1 | IO | SDS011